# Altium schematic sheet Serial IO Interface.SchDoc: Cypress Molson - Serial I/O's
size B; CompanyName: Linear Systems Ltd.; DrawnBy: G. Cosens; Engineer: G. Cosens; Organization: Linear Systems Ltd.; Address1: 1717 Dublin Avenue, Unit 1; Address2: Winnipeg, MB, Canada; Address3: R3H 0H2; DocumentNumber: LS7652; Revision: 1; SheetNumber: 09; SheetTotal: 12; DocumentName: Cypress Molson - Serial I/O's
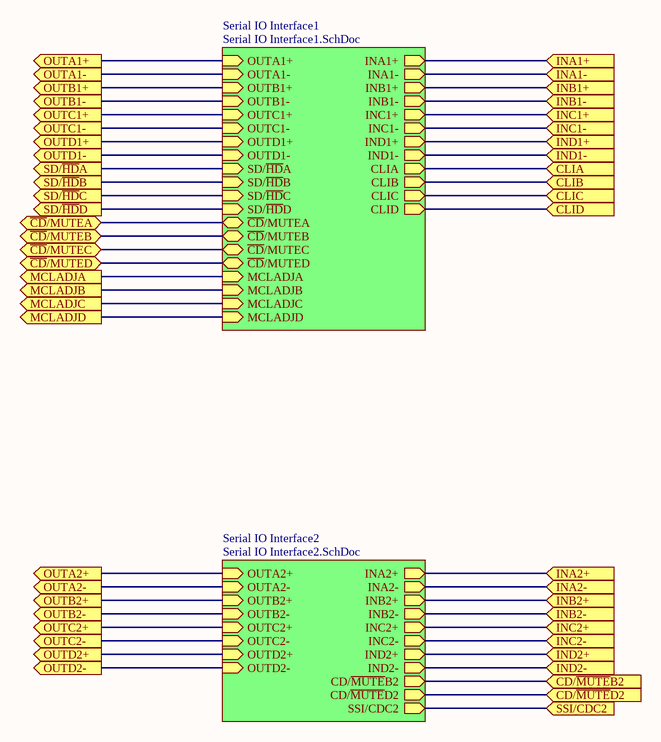
[diagram p0: Serial IO Interface.SchDoc]

## Sub-sheets
Serial IO Interface1 = Serial IO Interface1.SchDoc: OUTA1+ (in), OUTA1- (in), OUTB1+ (in), OUTB1- (in), OUTC1+ (in), OUTC1- (in), OUTD1+ (in), OUTD1- (in), INA1+ (out), INA1- (out), INB1+ (out), INB1- (out), INC1+ (out), INC1- (out), IND1+ (out), IND1- (out), SD/~{HD}A (in), SD/~{HD}B (in), SD/~{HD}C (in), SD/~{HD}D (in), ~{CD}/MUTEB (bidir), ~{CD}/MUTEC (bidir), ~{CD}/MUTEA (bidir), ~{CD}/MUTED (bidir), MCLADJA (in), MCLADJB (in), MCLADJC (in), MCLADJD (in), CLIA (out), CLIB (out), CLIC (out), CLID (out)
Serial IO Interface2 = Serial IO Interface2.SchDoc: OUTA2+ (in), OUTA2- (in), OUTB2+ (in), OUTB2- (in), OUTC2+ (in), OUTC2- (in), OUTD2+ (in), OUTD2- (in), INA2+ (out), INA2- (out), INB2+ (out), INB2- (out), INC2+ (out), INC2- (out), IND2+ (out), IND2- (out), CD/~{MUTE}B2 (out), CD/~{MUTE}D2 (out), SSI/CDC2 (out)

## Ports
CD/~{MUTE}B2 (in), CD/~{MUTE}D2 (in), CLIA (in), CLIB (in), CLIC (in), CLID (in), INA1+ (in), INA1- (in), INA2+ (in), INA2- (in), INB1+ (in), INB1- (in), INB2+ (in), INB2- (in), INC1+ (in), INC1- (in), INC2+ (in), INC2- (in), IND1+ (in), IND1- (in), IND2+ (in), IND2- (in), MCLADJA (out), MCLADJB (out), MCLADJC (out), MCLADJD (out), OUTA1+ (out), OUTA1- (out), OUTA2+ (out), OUTA2- (out), OUTB1+ (out), OUTB1- (out), OUTB2+ (out), OUTB2- (out), OUTC1+ (out), OUTC1- (out), OUTC2+ (out), OUTC2- (out), OUTD1+ (out), OUTD1- (out), OUTD2+ (out), OUTD2- (out), SD/~{HD}A (out), SD/~{HD}B (out), SD/~{HD}C (out), SD/~{HD}D (out), SSI/CDC2 (in), ~{CD}/MUTEA (bidir), ~{CD}/MUTEB (bidir), ~{CD}/MUTEC (bidir), ~{CD}/MUTED (bidir)

## Nets
~{CD}/MUTEA: port ~{CD}/MUTEA, sheet Serial IO Interface1/~{CD}/MUTEA
~{CD}/MUTEB: port ~{CD}/MUTEB, sheet Serial IO Interface1/~{CD}/MUTEB
~{CD}/MUTEC: port ~{CD}/MUTEC, sheet Serial IO Interface1/~{CD}/MUTEC
~{CD}/MUTED: port ~{CD}/MUTED, sheet Serial IO Interface1/~{CD}/MUTED
CD/~{MUTE}B2: port CD/~{MUTE}B2, sheet Serial IO Interface2/CD/~{MUTE}B2
CD/~{MUTE}D2: port CD/~{MUTE}D2, sheet Serial IO Interface2/CD/~{MUTE}D2
CLIA: port CLIA, sheet Serial IO Interface1/CLIA
CLIB: port CLIB, sheet Serial IO Interface1/CLIB
CLIC: port CLIC, sheet Serial IO Interface1/CLIC
CLID: port CLID, sheet Serial IO Interface1/CLID
INA1+: port INA1+, sheet Serial IO Interface1/INA1+
INA1-: port INA1-, sheet Serial IO Interface1/INA1-
INA2+: port INA2+, sheet Serial IO Interface2/INA2+
INA2-: port INA2-, sheet Serial IO Interface2/INA2-
INB1+: port INB1+, sheet Serial IO Interface1/INB1+
INB1-: port INB1-, sheet Serial IO Interface1/INB1-
INB2+: port INB2+, sheet Serial IO Interface2/INB2+
INB2-: port INB2-, sheet Serial IO Interface2/INB2-
INC1+: port INC1+, sheet Serial IO Interface1/INC1+
INC1-: port INC1-, sheet Serial IO Interface1/INC1-
INC2+: port INC2+, sheet Serial IO Interface2/INC2+
INC2-: port INC2-, sheet Serial IO Interface2/INC2-
IND1+: port IND1+, sheet Serial IO Interface1/IND1+
IND1-: port IND1-, sheet Serial IO Interface1/IND1-
IND2+: port IND2+, sheet Serial IO Interface2/IND2+
IND2-: port IND2-, sheet Serial IO Interface2/IND2-
MCLADJA: port MCLADJA, sheet Serial IO Interface1/MCLADJA
MCLADJB: port MCLADJB, sheet Serial IO Interface1/MCLADJB
MCLADJC: port MCLADJC, sheet Serial IO Interface1/MCLADJC
MCLADJD: port MCLADJD, sheet Serial IO Interface1/MCLADJD
OUTA1+: port OUTA1+, sheet Serial IO Interface1/OUTA1+
OUTA1-: port OUTA1-, sheet Serial IO Interface1/OUTA1-
OUTA2+: port OUTA2+, sheet Serial IO Interface2/OUTA2+
OUTA2-: port OUTA2-, sheet Serial IO Interface2/OUTA2-
OUTB1+: port OUTB1+, sheet Serial IO Interface1/OUTB1+
OUTB1-: port OUTB1-, sheet Serial IO Interface1/OUTB1-
OUTB2+: port OUTB2+, sheet Serial IO Interface2/OUTB2+
OUTB2-: port OUTB2-, sheet Serial IO Interface2/OUTB2-
OUTC1+: port OUTC1+, sheet Serial IO Interface1/OUTC1+
OUTC1-: port OUTC1-, sheet Serial IO Interface1/OUTC1-
OUTC2+: port OUTC2+, sheet Serial IO Interface2/OUTC2+
OUTC2-: port OUTC2-, sheet Serial IO Interface2/OUTC2-
OUTD1+: port OUTD1+, sheet Serial IO Interface1/OUTD1+
OUTD1-: port OUTD1-, sheet Serial IO Interface1/OUTD1-
OUTD2+: port OUTD2+, sheet Serial IO Interface2/OUTD2+
OUTD2-: port OUTD2-, sheet Serial IO Interface2/OUTD2-
SD/~{HD}A: port SD/~{HD}A, sheet Serial IO Interface1/SD/~{HD}A
SD/~{HD}B: port SD/~{HD}B, sheet Serial IO Interface1/SD/~{HD}B
SD/~{HD}C: port SD/~{HD}C, sheet Serial IO Interface1/SD/~{HD}C
SD/~{HD}D: port SD/~{HD}D, sheet Serial IO Interface1/SD/~{HD}D
SSI/CDC2: port SSI/CDC2, sheet Serial IO Interface2/SSI/CDC2

## Notes on the sheet
- Size
- Date:
- B
- Drawing Number
- Sheet
- Revision
- of
- File:
- Drawn By:
- G. Cosens